# EAGLE schematic board.01 (EAGLE 5.11)
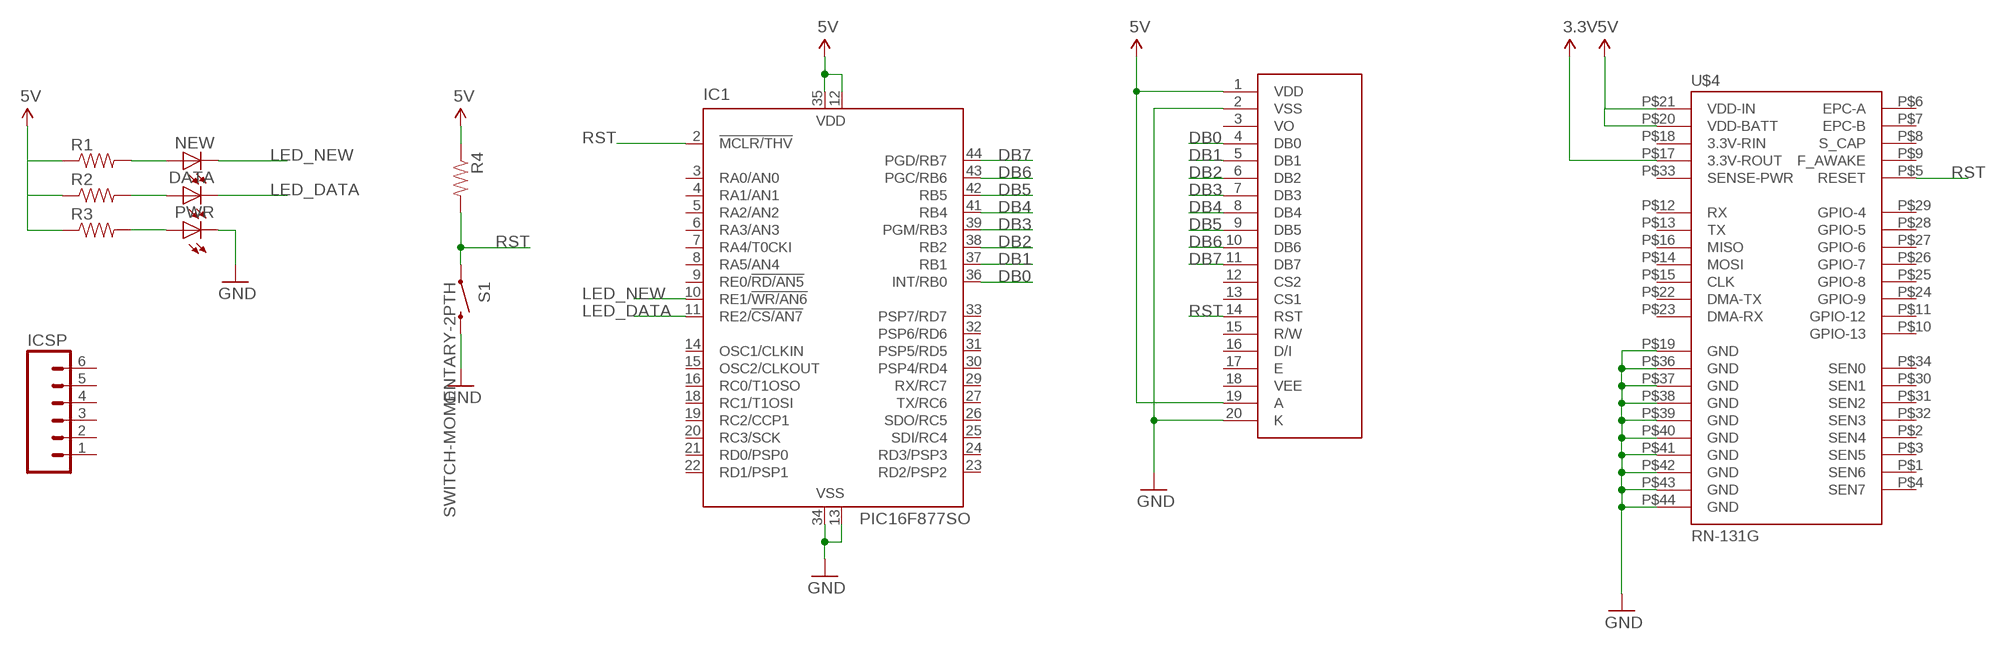
[diagram p0: schematic, sheet 1]

## Parts
DATA  LED1206  [LED-1206]
IC1  PIC16F877SO  [S44]
ICSP  M06RA_LOCK  [MOLEX-1X6-RA_LOCK]
NEW  LED1206  [LED-1206]
PWR  LED1206  [LED-1206]
R1  RESISTOR1206  [1206]
R2  RESISTOR1206  [1206]
R3  RESISTOR1206  [1206]
R4  RESISTOR1206  [1206]
S1  SWITCH-MOMENTARY-2PTH  [TACTILE-PTH]
U$3  LCD-G12864FULL  [LCD-G12864]
U$4  RN-131G  [RN-131G]

## Nets
3.3V: U$4.P$17(3.3V-ROUT)
5V: IC1.12(VDD) IC1.35(VDD) R1.1 R2.1 R3.1 R4.1 U$3.1(VDD) U$3.19(A) U$4.P$20(VDD-BATT) U$4.P$21(VDD-IN)
DB0: IC1.36(INT/RB0) U$3.4(DB0)
DB1: IC1.37(RB1) U$3.5(DB1)
DB2: IC1.38(RB2) U$3.6(DB2)
DB3: IC1.39(PGM/RB3) U$3.7(DB3)
DB4: IC1.41(RB4) U$3.8(DB4)
DB5: IC1.42(RB5) U$3.9(DB5)
DB6: IC1.43(PGC/RB6) U$3.10(DB6)
DB7: IC1.44(PGD/RB7) U$3.11(DB7)
GND: IC1.13(VSS) IC1.34(VSS) PWR.C S1.3 U$3.2(VSS) U$3.20(K) U$4.P$19(GND) U$4.P$36(GND) U$4.P$37(GND) U$4.P$38(GND) U$4.P$39(GND) U$4.P$40(GND) U$4.P$41(GND) U$4.P$42(GND) U$4.P$43(GND) U$4.P$44(GND)
LED_DATA: DATA.C IC1.11(RE2/!CS/AN7)
LED_NEW: IC1.10(RE1/!WR/AN6) NEW.C
N$1: NEW.A R1.2
N$2: DATA.A R2.2
N$3: PWR.A R3.2
RST: IC1.2(!MCLR/THV) R4.2 S1.1 U$3.14(RST) U$4.P$5(RESET)
Unconnected: IC1.3(RA0/AN0) IC1.4(RA1/AN1) IC1.5(RA2/AN2) IC1.6(RA3/AN3) IC1.7(RA4/T0CKI) IC1.8(RA5/AN4) IC1.9(RE0/!RD/AN5) IC1.14(OSC1/CLKIN) IC1.15(OSC2/CLKOUT) IC1.16(RC0/T1OSO) IC1.18(RC1/T1OSI) IC1.19(RC2/CCP1) IC1.20(RC3/SCK) IC1.21(RD0/PSP0) IC1.22(RD1/PSP1) IC1.23(RD2/PSP2) IC1.24(RD3/PSP3) IC1.25(SDI/RC4) IC1.26(SDO/RC5) IC1.27(TX/RC6) IC1.29(RX/RC7) IC1.30(PSP4/RD4) IC1.31(PSP5/RD5) IC1.32(PSP6/RD6) IC1.33(PSP7/RD7) ICSP.1 ICSP.2 ICSP.3 ICSP.4 ICSP.5 ICSP.6 U$3.3(VO) U$3.12(CS2) U$3.13(CS1) U$3.15(R/W) U$3.16(D/I) U$3.17(E) U$3.18(VEE) U$4.P$1(SEN6) U$4.P$2(SEN4) U$4.P$3(SEN5) U$4.P$4(SEN7) U$4.P$6(EPC-A) U$4.P$7(EPC-B) U$4.P$8(S_CAP) U$4.P$9(F_AWAKE) U$4.P$10(GPIO-13) U$4.P$11(GPIO-12) U$4.P$12(RX) U$4.P$13(TX) U$4.P$14(MOSI) U$4.P$15(CLK) U$4.P$16(MISO) U$4.P$18(3.3V-RIN) U$4.P$22(DMA-TX) U$4.P$23(DMA-RX) U$4.P$24(GPIO-9) U$4.P$25(GPIO-8) U$4.P$26(GPIO-7) U$4.P$27(GPIO-6) U$4.P$28(GPIO-5) U$4.P$29(GPIO-4) U$4.P$30(SEN1) U$4.P$31(SEN2) U$4.P$32(SEN3) U$4.P$33(SENSE-PWR) U$4.P$34(SEN0)

## Library data of the parts
DATA NEW PWR = SparkFun:LED: LEDs Standard schematic elements and footprints for 5mm, 3mm, 1206, and 0603 sized LEDs. 5mm - Spark Fun Electronics SKU : COM-00529 (and others)
IC1 = microchip:PIC16F87*: MICROCONTROLLER; OC_FARNELL: unknown; OC_NEWARK: unknown
ICSP = SparkFun:M06: Header 6 Standard 6-pin 0.1" header. Use with straight break away headers (SKU : PRT-00116), right angle break away headers (PRT-00553), swiss pins (PRT-00743), machine pins (PRT-00117), and female headers (PRT-00115). Molex polarized connector foot print use with SKU : PRT-08094 with associated crimp pins and housings. NOTES ON THE VARIANTS LOCK and LOCK_LONGPADS... This footprint was designed to help hold the alignment of a through-hole component (i.e. 6-pin header) while soldering it into place. You may notice that each hole has been shifted either up or down by 0.005 of an inch from it's more standard position (which is a perfectly straight line). This slight alteration caused the pins (the squares in the middle) to touch the edges of the holes. Because they are alternating, it causes a "brace" to hold the component in place. 0.005 has proven to be the perfect amount of "off-center" position when using our standard breakaway headers. Although looks a little odd when you look at the bare footprint, once you have a header in there, the alteration is very hard to notice. Also, if you push a header all the way into place, it is covered up entirely on the bottom side. This idea of altering the position of holes to aid alignment will be further integrated into the Sparkfun Library for other footprints. It can help hold any component with 3 or more connection pins.
R1-R4 = SparkFun:RESISTOR: Resistor Basic schematic elements and footprints for 0603, 1206, and PTH resistors.
S1 = SparkFun:SWITCH-MOMENTARY-2
U$3 = SparkFun:LCD-G12864: Graphical LCD 128x64 Footprint is not yet proven. Double check it. Spark Fun Electronics SKU : LCD-00710
U$4 = SparkFun:RN-131G: Roving Netowrks WiFLy GSX Module